# Altium schematic sheet MCU.SchDoc
size A; SheetNumber: 1; SheetTotal: 6
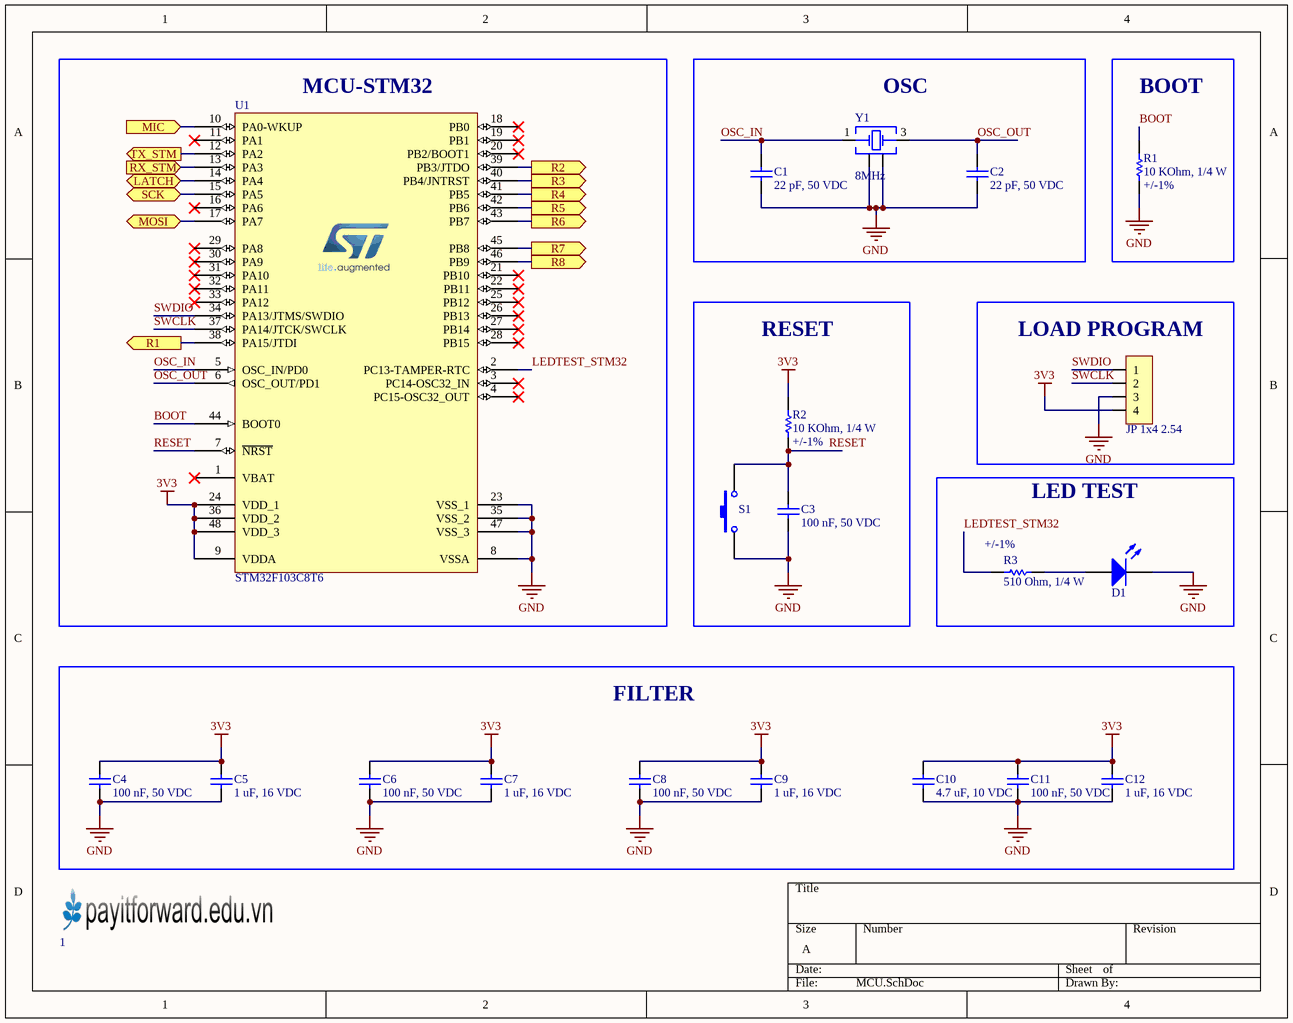
[diagram p0: MCU.SchDoc]

## Parts
1  LOGO PIF  [PIF LOGO SMALL TOP]  (value not drawn)
C1  22 pF, 50 VDC  [CAP_0603]
C2  22 pF, 50 VDC  [CAP_0603]
C3  100 nF, 50 VDC  [CAP_0603]
C4  100 nF, 50 VDC  [CAP_0603]
C5  1 uF, 16 VDC  [CAP_0603]
C6  100 nF, 50 VDC  [CAP_0603]
C7  1 uF, 16 VDC  [CAP_0603]
C8  100 nF, 50 VDC  [CAP_0603]
C9  1 uF, 16 VDC  [CAP_0603]
C10  4.7 uF, 10 VDC  [CAP_0603]
C11  100 nF, 50 VDC  [CAP_0603]
C12  1 uF, 16 VDC  [CAP_0603]
D1  LED SMD  [LED_0805_Blue]  (value not drawn)
JP1  JP 1x4 2.54  [JP 1x4 DT]
R1  10 KOhm, 1/4 W  Resistance Tolerance: +/-1%  [resistor_0603]
R2  10 KOhm, 1/4 W  Resistance Tolerance: +/-1%  [resistor_0603]
R3  510 Ohm, 1/4 W  Resistance Tolerance: +/-1%  [resistor_0603]
S1  Tact SW - 2Pin  [SW-SMD]  (value not drawn)
U1  STM32F103C8T6  [STM32F103C8T6]
Y1  8MHz  [WE-XTAL_CFPX-180]

## Blocks framed on the sheet
MCU-STM32: U1
OSC: C1 C2 Y1
BOOT: R1
RESET: C3 R2 S1
LOAD PROGRAM: JP1
LED TEST: D1 R3
FILTER: C4-C12

## Ports
LATCH (bidir, see Output[2B], Output[2C], Output[5B], Output[5C]), MIC (in, see Input[3A]), MOSI (bidir, see Output[5B]), R1 (out, see Output[2B]), R2 (out, see Output[2B]), R3 (out, see Output[2B]), R4 (out, see Output[2C]), R5 (out, see Output[2C]), R6 (out, see Output[2C]), R7 (out, see Output[2C]), R8 (out, see Output[2D]), RX_STM (in, see ESP32[3B]), SCK (bidir, see Output[2B], Output[2C], Output[5B], Output[5C]), TX_STM (out, see ESP32[3B])

## Nets
3V3: C4.2 C5.2 C6.2 C7.2 C8.2 C9.2 C10.2 C11.2 C12.2 JP1.4 R2.2 U1.9(VDDA) U1.24(VDD_1) U1.36(VDD_2) U1.48(VDD_3)
GND: C1.1 C2.1 C3.1 C4.1 C5.1 C6.1 C7.1 C8.1 C9.1 C10.1 C11.1 C12.1 D1.2(K) JP1.3 R1.1 S1.1 U1.8(VSSA) U1.23(VSS_1) U1.35(VSS_2) U1.47(VSS_3) Y1.2(GND&Lid) Y1.4(GND&Lid)
BOOT: R1.2 U1.44(BOOT0)
LATCH: U1.14(PA4) ; port LATCH
LEDTEST_STM32: R3.1 U1.2(PC13-TAMPER-RTC)
MIC: U1.10(PA0-WKUP) ; port MIC
MOSI: U1.17(PA7) ; port MOSI
OSC_IN: C1.2 U1.5(OSC_IN/PD0) Y1.1(Crystal)
OSC_OUT: C2.2 U1.6(OSC_OUT/PD1) Y1.3(Crystal)
R1: U1.38(PA15/JTDI) ; port R1
R2: U1.39(PB3/JTDO) ; port R2
R3: U1.40(PB4/JNTRST) ; port R3
R4: U1.41(PB5) ; port R4
R5: U1.42(PB6) ; port R5
R6: U1.43(PB7) ; port R6
R7: U1.45(PB8) ; port R7
R8: U1.46(PB9) ; port R8
RESET: C3.2 R2.1 S1.2 U1.7(~{NRST})
RX_STM: U1.13(PA3) ; port RX_STM
SCK: U1.15(PA5) ; port SCK
SWCLK: JP1.2 U1.37(PA14/JTCK/SWCLK)
SWDIO: JP1.1 U1.34(PA13/JTMS/SWDIO)
TX_STM: U1.12(PA2) ; port TX_STM
NetD1_1: D1.1(A) R3.2

Not connected (* = marked no-connect by the designer): U1 1(VBAT)* 3(PC14-OSC32_IN)* 4(PC15-OSC32_OUT)* 11(PA1)* 16(PA6)* 18(PB0)* 19(PB1)* 20(PB2/BOOT1)* 21(PB10)* 22(PB11)* 25(PB12)* 26(PB13)* 27(PB14)* 28(PB15)* 29(PA8)* 30(PA9)* 31(PA10)* 32(PA11)* 33(PA12)*

## Library data of the parts
C1 C2 = 0106032200550: CAP, size 0603, 22 pF, 50 VDC; Manufacture Name: TDK; Manufacture SN: CGA3E2NP01H220J080AA; Capacitance: 22 pF; Tolerance: +/-5%; Voltage Rating DC: 50 VDC; ComponentLink2Description: Datasheet; ComponentLink2URL: https://product.tdk.com/system/files/dam/doc/product/capacitor/ceramic/mlcc/catalog/mlcc_automotive_hightemp_en.pdf?ref_disty=mouser; Operating Temperature: -55 to +125degC; Packaging: Tape and Reel; Mounting Technology: SMT; Size: 0603; Supplier 1 Name: Mouser; Supplier 1 SN: 810-CGA3E2NP01H220JA; Supplier 1 URL: https://www.mouser.com/ProductDetail/TDK/CGA3E2NP01H220J080AA?qs=xLDY6iXSiQbIDiPJq57tVA%3D%3D&utm_source=mouser-refine-download&utm_medium=file&utm_campaign=CGA3E2NP01H220J080AA&utm_content=TDK; Supplier 2 Name: Digi-Key; Supplier 2 SN: 445-12401-2-ND; Supplier 2 URL: https://www.digikey.com/en/products/detail/tdk-corporation/cga3e2np01h220j080aa/3949637; Supplier 3 Name: thegioiic; Supplier 3 SN: N/A; Supplier 3 URL: N/A; Value: 22 pF, 50 VDC
C3 C4 C6 C8 C11 = 0106031041050: CAP, size 0603, 100 nF, 50 VDC; Manufacture Name: TDK; Manufacture SN: CGA3E3X8R1H104K080AE; Capacitance: 100 nF; Tolerance: +/-10%; Voltage Rating DC: 50 VDC; ComponentLink2Description: Datasheet; ComponentLink2URL: https://product.tdk.com/system/files/dam/doc/product/capacitor/ceramic/mlcc/catalog/mlcc_automotive_soft_en.pdf?ref_disty=mouser; Operating Temperature: -55 to +125degC; Packaging: Tape and Reel; Mounting Technology: SMT; Size: 0603; Supplier 1 Name: Mouser; Supplier 1 SN: 810-CGA3E3X8R1H104KA; Supplier 1 URL: https://www.mouser.com/ProductDetail/TDK/CGA3E3X8R1H104K080AE?qs=nQSIdc08i%252Bd8g3IRRgU2bw%3D%3D&utm_source=mouser-refine-download&utm_medium=file&utm_campaign=CGA3E3X8R1H104K080AE&utm_content=TDK; Supplier 2 Name: Digi-Key; Supplier 2 SN: 445-173697-2-ND; Supplier 2 URL: https://www.digikey.com/en/products/detail/tdk-corporation/cga3e3x8r1h104k080ae/5809262; Supplier 3 Name: thegioiic; Supplier 3 SN: N/A; Supplier 3 URL: N/A; Value: 100 nF, 50 VDC
C5 C7 C9 C12 = 0106031051016: CAP, size 0603, 1 uF, 16 VDC; Manufacture Name: Samsung Electro-Mechanics; Manufacture SN: CL10B105KO8NNWC; Capacitance: 1 uF; Tolerance: +/-10%; Voltage Rating DC: 16 VDC; ComponentLink2Description: Datasheet; ComponentLink2URL: https://www.mouser.vn/datasheet/2/585/Samsung_MLCC_1837944-1929650.pdf; Operating Temperature: -55 to +125degC; Packaging: Tape and Reel; Mounting Technology: SMT; Size: 0603; Supplier 1 Name: Mouser; Supplier 1 SN: 187-CL10B105KO8NNWC; Supplier 1 URL: https://www.mouser.vn/ProductDetail/Samsung-Electro-Mechanics/CL10B105KO8NNWC?qs=81r%252BiQLm7BT%252BXtc72qn1ug%3D%3D&utm_source=mouser-refine-download&utm_medium=file&utm_campaign=CL10B105KO8NNWC&utm_content=Samsung-Electro-Mechanics; Supplier 2 Name: Digi-Key; Supplier 2 SN: 1276-CL10B105KO8NNWCTR-ND; Supplier 2 URL: https://www.digikey.com/en/products/detail/samsung-electro-mechanics/cl10b105ko8nnwc/16572783; Supplier 3 Name: thegioiic; Supplier 3 SN: N/A; Supplier 3 URL: https://www.thegioiic.com/tu-gom-0603-1uf-16v; Value: 1 uF, 16 VDC
C10 = 0106034751010: CAP, size 0603, 4.7 uF, 10 VDC; Manufacture Name: Samsung Electro-Mechanics; Manufacture SN: CL10A475KP8NNWC; Capacitance: 4.7 uF; Tolerance: +/-10%; Voltage Rating DC: 10 VDC; ComponentLink2Description: Datasheet; ComponentLink2URL: https://www.mouser.vn/datasheet/2/585/Samsung_MLCC_1837944-1929650.pdf; Operating Temperature: -55 to +125degC; Packaging: Tape and Reel; Mounting Technology: SMT; Size: 0603; Supplier 1 Name: Mouser; Supplier 1 SN: 187-CL10A475KP8NNWC; Supplier 1 URL: https://www.mouser.vn/ProductDetail/Samsung-Electro-Mechanics/CL10A475KP8NNWC?qs=81r%252BiQLm7BQyXBb52PEUBA%3D%3D&utm_source=mouser-refine-download&utm_medium=file&utm_campaign=CL10A475KP8NNWC&utm_content=Samsung-Electro-Mechanics; Supplier 2 Name: Digi-Key; Supplier 2 SN: 1276-CL10A475KP8NNWCTR-ND; Supplier 2 URL: https://www.digikey.com/en/products/detail/samsung-electro-mechanics/cl10a475kp8nnwc/16572736; Supplier 3 Name: thegioiic; Supplier 3 SN: N/A; Supplier 3 URL: https://www.thegioiic.com/tu-gom-0603-4-7uf-25v; Value: 4.7 uF, 10 VDC
D1 = LED SMD: LED
JP1 = JP 1x4 2.54 Duc Thang: Cắm; Ten_Linh_Kien: Jump Đơn Đực 2.54MM 1x40P Thẳng 11MM; Don_Vi: Con; Ma_Hang: MH000903; Ghi_Chu: *; Kieu_Chan: *; Chung_Loai: Cắm
R1 R2 = 0006031031: RES, size 0603, 10 KOhm, 1/4 W; Manufacture  Name: OEM; Resistance: 10 KOhm; Rated Power: 1/4 W; Size: 0603; Mounting Technology: SMT; Supplier 1 Name: Mouser; Supplier 1 SN: 755-ESR03EZPF1002; Supplier 2 Name: Digi-Key; Supplier 2 SN: RHM10KADTR-ND RHM10KADCT-ND RHM10KADDKR-ND; Supplier 1 URL: https://www.mouser.vn/ProductDetail/ROHM-Semiconductor/ESR03EZPF1002?qs=sGAEpiMZZMvdGkrng054t67Efho1F8r6CDeAsqwFse8%3D; Supplier 3 Name: thegioiic; Supplier 3 SN: N/A; Supplier 3 URL: N/A; Manufacture  SN: OEM; Value: 10 KOhm, 1/4 W; ComponentLink1Description: Datasheet link; ComponentLink1URL: https://fscdn.rohm.com/en/products/databook/datasheet/passive/resistor/chip_resistor/esr-e.pdf; ComponentLink2Description: Supplier 1 URL; ComponentLink2URL: N/A; ComponentLink3Description: Supplier 2 URL; ComponentLink3URL: https://www.digikey.com/en/products/detail/rohm-semiconductor/ESR03EZPF1002/1983429; ComponentLink4Description: Supplier 3 URL; ComponentLink4URL: N/A; Supplier 2 URL: https://www.digikey.com/en/products/detail/rohm-semiconductor/ESR03EZPF1002/1983429
R3 = 0006035111: RES, size 0603, 510 Ohm, 1/4 W; Manufacture  Name: OEM; Resistance: 510 Ohm; Rated Power: 1/4 W; Size: 0603; Mounting Technology: SMT; Supplier 1 Name: Mouser; Supplier 1 SN: 667-ERJ-UP3F5100V; Supplier 2 Name: Digi-Key; Supplier 2 SN: P17401TR-ND P17401CT-ND P17401DKR-ND; Supplier 1 URL: https://www.mouser.vn/ProductDetail/Panasonic/ERJ-UP3F5100V?qs=sGAEpiMZZMvdGkrng054twq3eZrCFN89dfK8VohwH1n5T5ZGAc92MQ%3D%3D; Supplier 3 Name: thegioiic; Supplier 3 SN: N/A; Supplier 3 URL: N/A; Manufacture  SN: OEM; Value: 510 Ohm, 1/4 W; ComponentLink1Description: Datasheet link; ComponentLink1URL: https://industrial.panasonic.com/cdbs/www-data/pdf/RDN0000/AOA0000C313.pdf; ComponentLink2Description: Supplier 1 URL; ComponentLink2URL: N/A; ComponentLink3Description: Supplier 2 URL; ComponentLink3URL: https://www.digikey.com/en/products/detail/panasonic-electronic-components/ERJ-3BQFR51V/5647434; ComponentLink4Description: Supplier 3 URL; ComponentLink4URL: N/A; Supplier 2 URL: https://www.digikey.com/en/products/detail/panasonic-electronic-components/ERJ-3BQFR51V/5647434
S1 = Tact SW - 2Pin: Switch button 2 pin
U1 = STM32F103C8T6: ARM Microcontrollers - MCU 32BIT Cortex M3 64KB 20KB RAM 2X12 ADC; Manufacturer: STM; Manufacture SN: STM32F103C8T6TR; Pad count: 48; ComponentLink1Description: Datasheet; Part Number: STM32F103C8T6; Value: STM32F103C8T6; ComponentLink1URL: https://www.mouser.com/datasheet/2/389/stm32f103c8-1851025.pdf; Footprint name: LQFP48; ComponentLink2Description: Supplier 1 URL; ComponentLink2URL: https://www.mouser.com/ProductDetail/STMicroelectronics/STM32F103C8T6?qs=bhCVus9SdFtq6kqxsU5%2FDA%3D%3D; ComponentLink3Description: Supplier 2 URL; ComponentLink3URL: 497-17666-2-ND; ComponentLink4Description: Supplier 3 URL; ComponentLink4URL: https://www.thegioiic.com/stm32f103c8t6-32-bit-arm-cortex-m3-microcontroller-72mhz-64kb-flash-48-lqfp; Supplier 1 Name: Mouser; Supplier 1 SN: 511-STM32F103C8T6; Supplier 1 URL: https://www.mouser.com/ProductDetail/STMicroelectronics/STM32F103C8T6?qs=bhCVus9SdFtq6kqxsU5%2FDA%3D%3D; Supplier 2 Name: Digi-Key; Supplier 2 SN: 497-17666-2-ND; Supplier 2 URL: https://www.digikey.com/en/products/detail/stmicroelectronics/stm32f103c8t6tr/2122442; Supplier 3 Name: thegioiic; Supplier 3 SN: STM32F103C8T6; Supplier 3 URL: https://www.thegioiic.com/stm32f103c8t6-32-bit-arm-cortex-m3-microcontroller-72mhz-64kb-flash-48-lqfp
Y1 = 830108313809: WE-XTAL Quartz Crystal, SMT, CFPX-180, 8MHz, +/-30ppm; Manufacturer: Wurth Elektronik; Frequency Stability: +/-50ppm; Load Capacitance: 12pF; ComponentLink1Description: Manufacturer; ComponentLink1URL: http://www.we-online.de; ComponentLink2Description: Datasheet; ComponentLink2URL: https://www.we-online.com/catalog/datasheet/830108313809.pdf; Operating Temperature: -40 to +85degC; Packaging: Tape and Reel; Manufacturer Part Number: 830108313809; Published Date: November 2020; Size: CFPX-180; Frequency: 8MHz; Frequency Tolerance: +/-30ppm; Mounting Technology: SMT